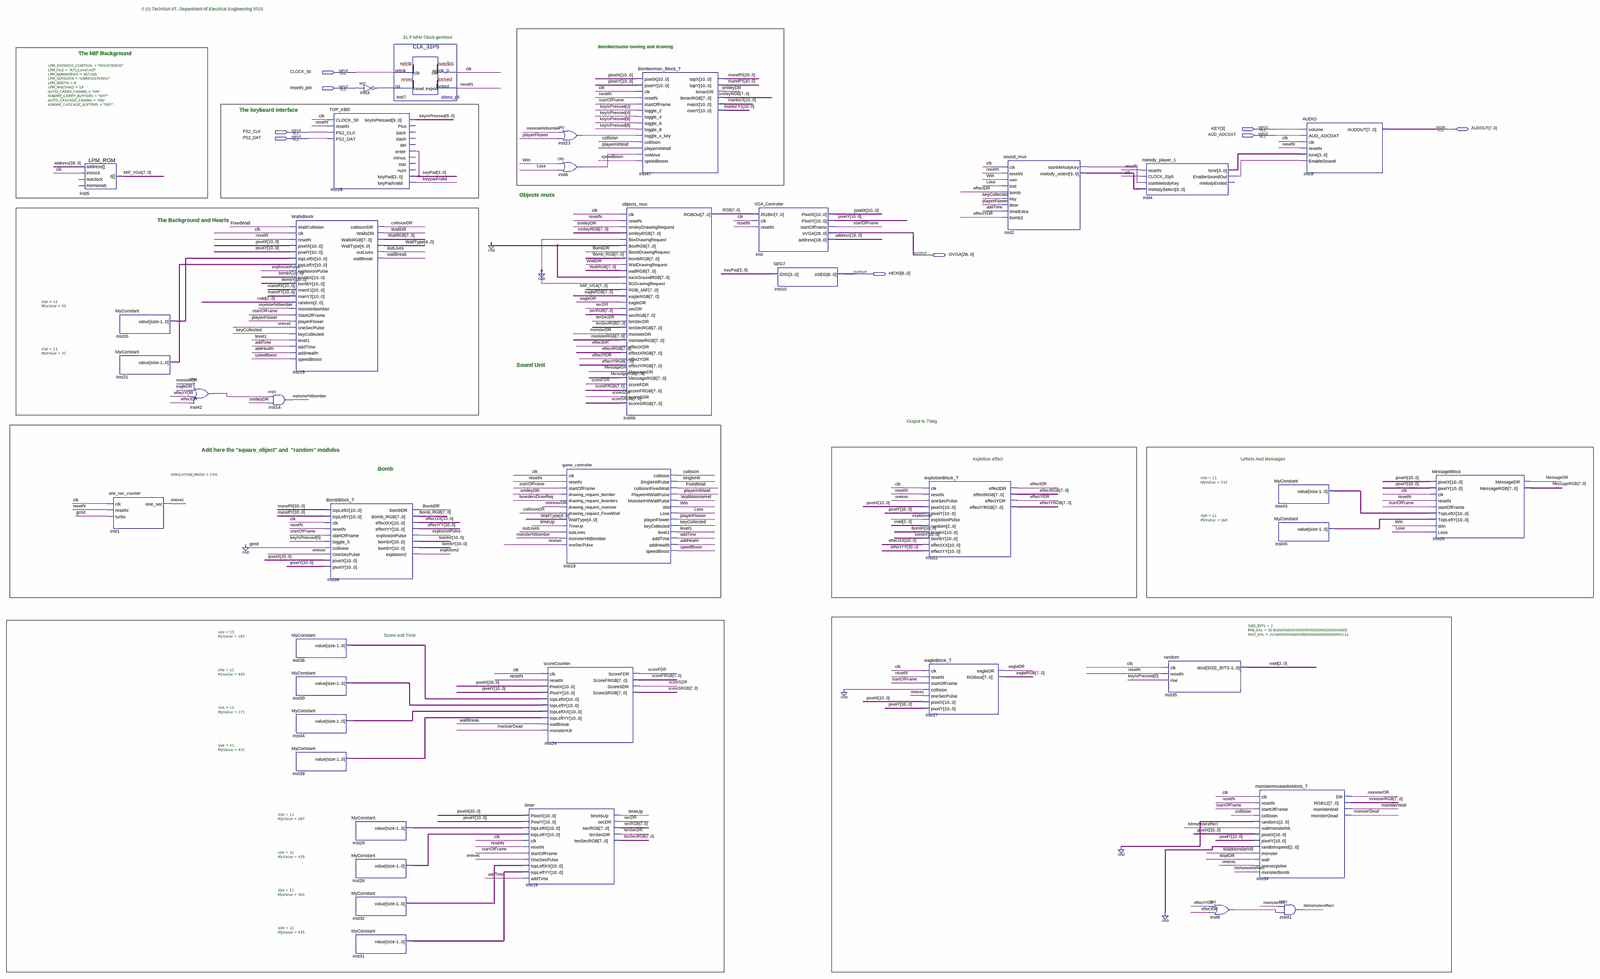
[diagram p0: schematic sheet, whole]
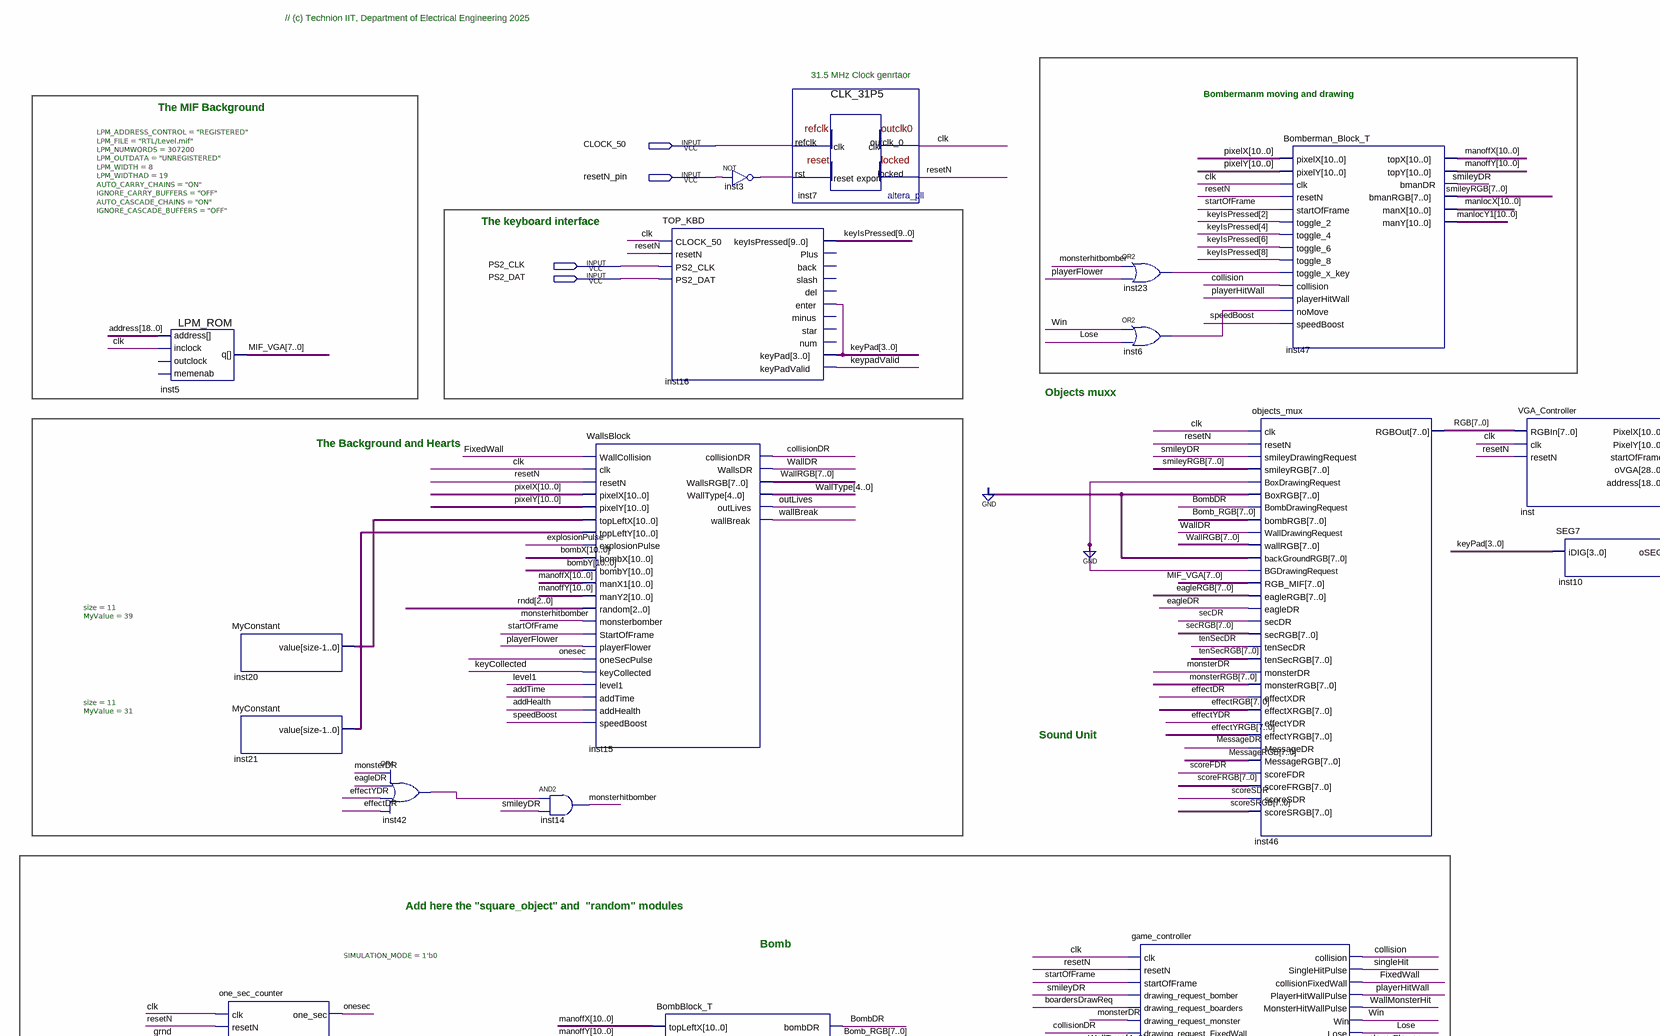
[diagram p1: schematic sheet, upper left part]
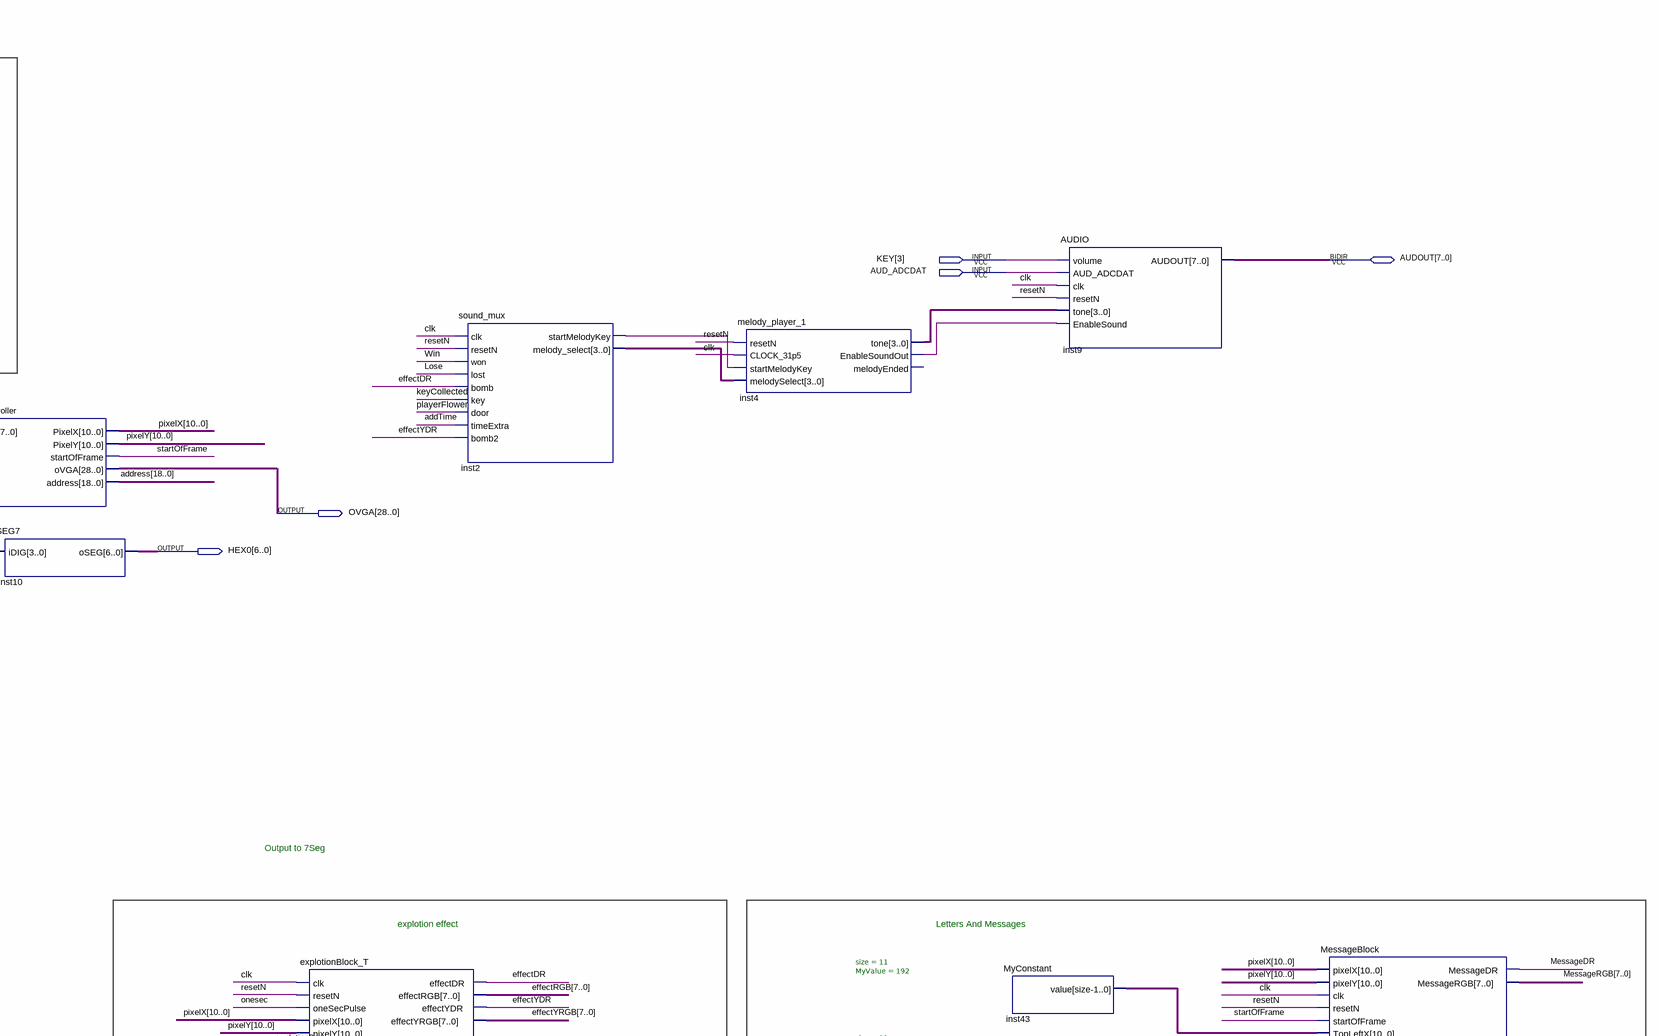
[diagram p2: schematic sheet, upper right part]
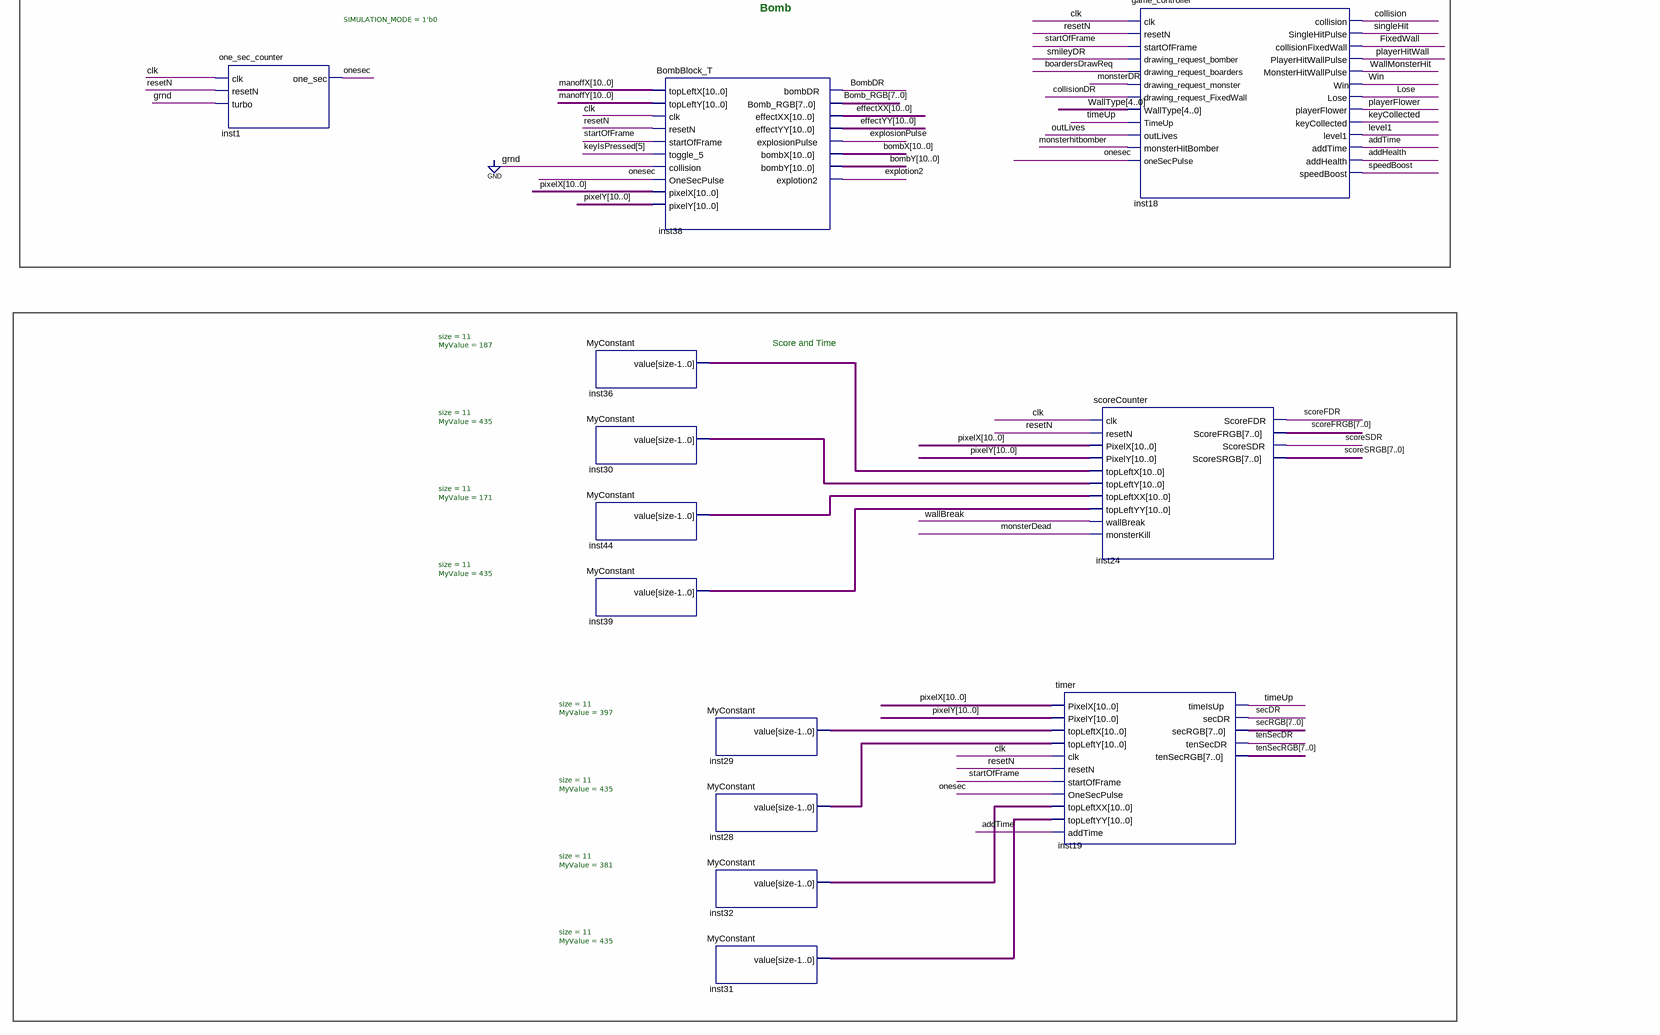
[diagram p3: schematic sheet, lower left part]
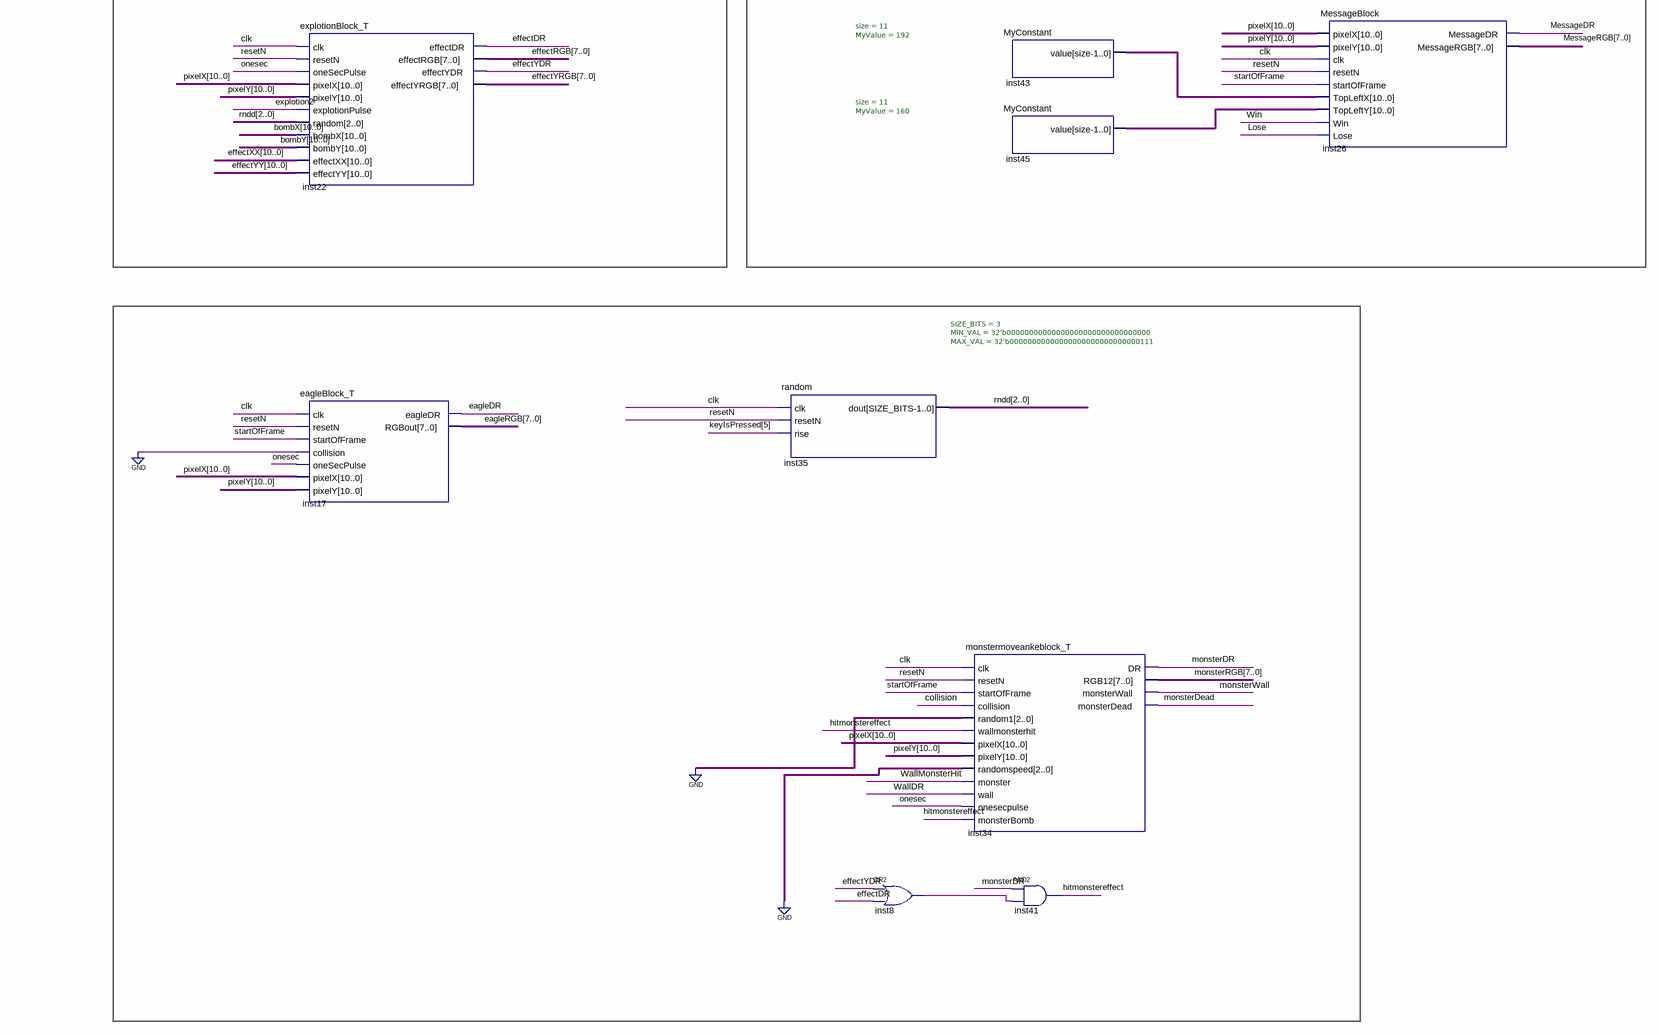
[diagram p4: schematic sheet, lower right part]
// Quartus schematic TOP_VGA_DEMO_KBD.bdf as structural Verilog: 40 symbols, 9 pins
module TOP_VGA_DEMO_KBD (
  input  CLOCK_50,
  input  resetN_pin,
  input  [3:3] KEY,
  input  PS2_CLK,
  input  AUD_ADCDAT,
  input  PS2_DAT,
  inout  [7:0] AUDOUT,
  output [28:0] OVGA,
  output [6:0] HEX0
);

  wire addHealth, addTime, boardersDrawReq, BombDR, clk, collision, collisionDR, eagleDR, effectDR,
       effectYDR, explosionPulse, explotion2, FixedWall, hitmonstereffect, inst2_startmelodykey, inst3_out,
       inst4_enablesoundout, inst6_out, inst8_out, inst16_enter, inst23_out, inst42_out, keyCollected,
       keypadValid, level1, Lose, MessageDR, monsterDead, monsterDR, monsterhitbomber, monsterWall, onesec,
       outLives, playerFlower, playerHitWall, resetN, scoreFDR, scoreSDR, secDR, singleHit, smileyDR,
       speedBoost, startOfFrame, tenSecDR, timeUp, wallBreak, WallDR, WallMonsterHit, Win;
  wire [2:0] rndd;
  wire [3:0] inst2_melody_select, inst4_tone, keyPad;
  wire [4:0] WallType;
  wire [7:0] Bomb_RGB, eagleRGB, effectRGB, effectYRGB, MessageRGB, MIF_VGA, monsterRGB, RGB, scoreFRGB,
       scoreSRGB, secRGB, smileyRGB, tenSecRGB, WallRGB;
  wire [9:0] keyIsPressed;
  wire [10:0] bombX, bombY, effectXX, effectYY, inst20_value, inst21_value, inst28_value, inst29_value,
       inst30_value, inst31_value, inst32_value, inst36_value, inst39_value, inst43_value, inst44_value,
       inst45_value, manlocX, manlocY1, manoffX, manoffY, pixelX, pixelY;
  wire [18:0] address;

  LPM_ROM #(.LPM_ADDRESS_CONTROL("REGISTERED"), .LPM_FILE("RTL/Level.mif"), .LPM_NUMWORDS(307200), .LPM_OUTDATA("UNREGISTERED"), .LPM_WIDTH(8), .LPM_WIDTHAD(19), .AUTO_CARRY_CHAINS("ON"), .IGNORE_CARRY_BUFFERS("OFF"), .AUTO_CASCADE_CHAINS("ON"), .IGNORE_CASCADE_BUFFERS("OFF")) inst5 (
    .address(address), .inclock(clk), .q(MIF_VGA));  // open: outclock, memenab
  MyConstant #(.size(11), .MyValue(39)) inst20 (.value(inst20_value));
  MyConstant #(.size(11), .MyValue(31)) inst21 (.value(inst21_value));
  one_sec_counter #(.SIMULATION_MODE(1'b0)) inst1 (.clk(clk), .resetN(resetN), .turbo(1'b0), .one_sec(onesec));
  or inst42 (inst42_out, monsterDR, eagleDR, effectYDR, effectDR);
  WallsBlock inst15 (
    .WallCollision(FixedWall), .clk(clk), .resetN(resetN), .pixelX(pixelX), .pixelY(pixelY),
    .topLeftX(inst20_value), .topLeftY(inst21_value), .explosionPulse(explosionPulse), .bombX(bombX),
    .bombY(bombY), .manX1(manoffX), .manY2(manoffY), .random(rndd), .monsterbomber(monsterhitbomber),
    .StartOfFrame(startOfFrame), .playerFlower(playerFlower), .oneSecPulse(onesec),
    .keyCollected(keyCollected), .level1(level1), .addTime(addTime), .addHealth(addHealth),
    .speedBoost(speedBoost), .collisionDR(collisionDR), .WallsDR(WallDR), .WallsRGB(WallRGB),
    .WallType(WallType), .outLives(outLives), .wallBreak(wallBreak));
  and inst14 (monsterhitbomber, inst42_out, smileyDR);
  MyConstant #(.size(11), .MyValue(187)) inst36 (.value(inst36_value));
  MyConstant #(.size(11), .MyValue(435)) inst30 (.value(inst30_value));
  MyConstant #(.size(11), .MyValue(171)) inst44 (.value(inst44_value));
  MyConstant #(.size(11), .MyValue(435)) inst39 (.value(inst39_value));
  TOP_KBD inst16 (
    .CLOCK_50(clk), .resetN(resetN), .PS2_CLK(PS2_CLK), .PS2_DAT(PS2_DAT), .keyIsPressed(keyIsPressed),
    .enter(inst16_enter), .keyPad(keyPad), .keyPadValid(keypadValid));  // open: Plus, back, slash, del, minus, star, num
  BombBlock_T inst38 (
    .topLeftX(manoffX), .topLeftY(manoffY), .clk(clk), .resetN(resetN), .startOfFrame(startOfFrame),
    .toggle_5(keyIsPressed[5]), .collision(1'b0), .OneSecPulse(onesec), .pixelX(pixelX), .pixelY(pixelY),
    .bombDR(BombDR), .Bomb_RGB(Bomb_RGB), .effectXX(effectXX), .effectYY(effectYY),
    .explosionPulse(explosionPulse), .bombX(bombX), .bombY(bombY), .explotion2(explotion2));
  not inst3 (inst3_out, resetN_pin);
  MyConstant #(.size(11), .MyValue(397)) inst29 (.value(inst29_value));
  MyConstant #(.size(11), .MyValue(435)) inst28 (.value(inst28_value));
  MyConstant #(.size(11), .MyValue(381)) inst32 (.value(inst32_value));
  MyConstant #(.size(11), .MyValue(435)) inst31 (.value(inst31_value));
  CLK_31P5 inst7 (.refclk(CLOCK_50), .rst(inst3_out), .outclk_0(clk), .locked(resetN));
  scoreCounter inst24 (
    .clk(clk), .resetN(resetN), .PixelX(pixelX), .PixelY(pixelY), .topLeftX(inst36_value),
    .topLeftY(inst30_value), .topLeftXX(inst44_value), .topLeftYY(inst39_value), .wallBreak(wallBreak),
    .monsterKill(monsterDead), .ScoreFDR(scoreFDR), .ScoreFRGB(scoreFRGB), .ScoreSDR(scoreSDR),
    .ScoreSRGB(scoreSRGB));
  timer inst19 (
    .PixelX(pixelX), .PixelY(pixelY), .topLeftX(inst29_value), .topLeftY(inst28_value), .clk(clk),
    .resetN(resetN), .startOfFrame(startOfFrame), .OneSecPulse(onesec), .topLeftXX(inst32_value),
    .topLeftYY(inst31_value), .addTime(addTime), .timeIsUp(timeUp), .secDR(secDR), .secRGB(secRGB),
    .tenSecDR(tenSecDR), .tenSecRGB(tenSecRGB));
  or inst23 (inst23_out, monsterhitbomber, playerFlower);
  or inst6 (inst6_out, Win, Lose);
  game_controller inst18 (
    .clk(clk), .resetN(resetN), .startOfFrame(startOfFrame), .drawing_request_bomber(smileyDR),
    .drawing_request_boarders(boardersDrawReq), .drawing_request_monster(monsterDR),
    .drawing_request_FixedWall(collisionDR), .WallType(WallType), .TimeUp(timeUp), .outLives(outLives),
    .monsterHitBomber(monsterhitbomber), .oneSecPulse(onesec), .collision(collision),
    .SingleHitPulse(singleHit), .collisionFixedWall(FixedWall), .PlayerHitWallPulse(playerHitWall),
    .MonsterHitWallPulse(WallMonsterHit), .Win(Win), .Lose(Lose), .playerFlower(playerFlower),
    .keyCollected(keyCollected), .level1(level1), .addTime(addTime), .addHealth(addHealth),
    .speedBoost(speedBoost));
  Bomberman_Block_T inst47 (
    .pixelX(pixelX), .pixelY(pixelY), .clk(clk), .resetN(resetN), .startOfFrame(startOfFrame),
    .toggle_2(keyIsPressed[2]), .toggle_4(keyIsPressed[4]), .toggle_6(keyIsPressed[6]),
    .toggle_8(keyIsPressed[8]), .toggle_x_key(inst23_out), .collision(collision),
    .playerHitWall(playerHitWall), .noMove(inst6_out), .speedBoost(speedBoost), .topX(manoffX),
    .topY(manoffY), .bmanDR(smileyDR), .bmanRGB(smileyRGB), .manX(manlocX), .manY(manlocY1));
  objects_mux inst46 (
    .clk(clk), .resetN(resetN), .smileyDrawingRequest(smileyDR), .smileyRGB(smileyRGB),
    .BoxDrawingRequest(1'b0), .BoxRGB({8{1'b0}}), .BombDrawingRequest(BombDR), .bombRGB(Bomb_RGB),
    .WallDrawingRequest(WallDR), .wallRGB(WallRGB), .backGroundRGB({8{1'b0}}), .BGDrawingRequest(1'b0),
    .RGB_MIF(MIF_VGA), .eagleRGB(eagleRGB), .eagleDR(eagleDR), .secDR(secDR), .secRGB(secRGB),
    .tenSecDR(tenSecDR), .tenSecRGB(tenSecRGB), .monsterDR(monsterDR), .monsterRGB(monsterRGB),
    .effectXDR(effectDR), .effectXRGB(effectRGB), .effectYDR(effectYDR), .effectYRGB(effectYRGB),
    .MessageDR(MessageDR), .MessageRGB(MessageRGB), .scoreFDR(scoreFDR), .scoreFRGB(scoreFRGB),
    .scoreSDR(scoreSDR), .scoreSRGB(scoreSRGB), .RGBOut(RGB));
  VGA_Controller inst (
    .RGBIn(RGB), .clk(clk), .resetN(resetN), .PixelX(pixelX), .PixelY(pixelY), .startOfFrame(startOfFrame),
    .oVGA(OVGA), .address(address));
  SEG7 inst10 (.iDIG(keyPad), .oSEG(HEX0));
  explotionBlock_T inst22 (
    .clk(clk), .resetN(resetN), .oneSecPulse(onesec), .pixelX(pixelX), .pixelY(pixelY),
    .explotionPulse(explotion2), .random(rndd), .bombX(bombX), .bombY(bombY), .effectXX(effectXX),
    .effectYY(effectYY), .effectDR(effectDR), .effectRGB(effectRGB), .effectYDR(effectYDR),
    .effectYRGB(effectYRGB));
  eagleBlock_T inst17 (
    .clk(clk), .resetN(resetN), .startOfFrame(startOfFrame), .collision(1'b0), .oneSecPulse(onesec),
    .pixelX(pixelX), .pixelY(pixelY), .eagleDR(eagleDR), .RGBout(eagleRGB));
  sound_mux inst2 (
    .clk(clk), .resetN(resetN), .won(Win), .lost(Lose), .bomb(effectDR), .key(keyCollected),
    .door(playerFlower), .timeExtra(addTime), .bomb2(effectYDR), .startMelodyKey(inst2_startmelodykey),
    .melody_select(inst2_melody_select));
  melody_player_1 inst4 (
    .resetN(resetN), .CLOCK_31p5(clk), .startMelodyKey(inst2_startmelodykey),
    .melodySelect(inst2_melody_select), .tone(inst4_tone), .EnableSoundOut(inst4_enablesoundout));  // open: melodyEnded
  random #(.SIZE_BITS(3), .MIN_VAL(32'b00000000000000000000000000000000), .MAX_VAL(32'b00000000000000000000000000000111)) inst35 (
    .clk(clk), .resetN(resetN), .rise(keyIsPressed[5]), .dout(rndd));
  or inst8 (inst8_out, effectYDR, effectDR);
  MyConstant #(.size(11), .MyValue(192)) inst43 (.value(inst43_value));
  MyConstant #(.size(11), .MyValue(160)) inst45 (.value(inst45_value));
  monstermoveankeblock_T inst34 (
    .clk(clk), .resetN(resetN), .startOfFrame(startOfFrame), .collision(collision), .random1(3'b000),
    .wallmonsterhit(hitmonstereffect), .pixelX(pixelX), .pixelY(pixelY), .randomspeed(3'b000),
    .monster(WallMonsterHit), .wall(WallDR), .onesecpulse(onesec), .monsterBomb(hitmonstereffect),
    .DR(monsterDR), .RGB12(monsterRGB), .monsterWall(monsterWall), .monsterDead(monsterDead));
  and inst41 (hitmonstereffect, monsterDR, inst8_out);
  AUDIO inst9 (
    .volume(KEY[3]), .AUD_ADCDAT(AUD_ADCDAT), .clk(clk), .resetN(resetN), .tone(inst4_tone),
    .EnableSound(inst4_enablesoundout), .AUDOUT(AUDOUT));
  MessageBlock inst26 (
    .pixelX(pixelX), .pixelY(pixelY), .clk(clk), .resetN(resetN), .startOfFrame(startOfFrame),
    .TopLeftX(inst43_value), .TopLeftY(inst45_value), .Win(Win), .Lose(Lose), .MessageDR(MessageDR),
    .MessageRGB(MessageRGB));

  // Notes on the sheet:
  //   // (c) Technion IIT, Department of Electrical Engineering 2025
  //   31.5 MHz Clock genrtaor
  //   Bombermanm moving and drawing
  //   The MIF Background
  //   The keyboard interface
  //   Objects muxx
  //   The Background and Hearts
  //   Sound Unit
  //   Output to 7Seg
  //   Add here the "square_object" and  "random" modules
  //   explotion effect
  //   Letters And Messages
  //   Bomb
  //   Score and Time
endmodule
